# Altium schematic sheet MINIRACER-POWER.SchDoc
size A4
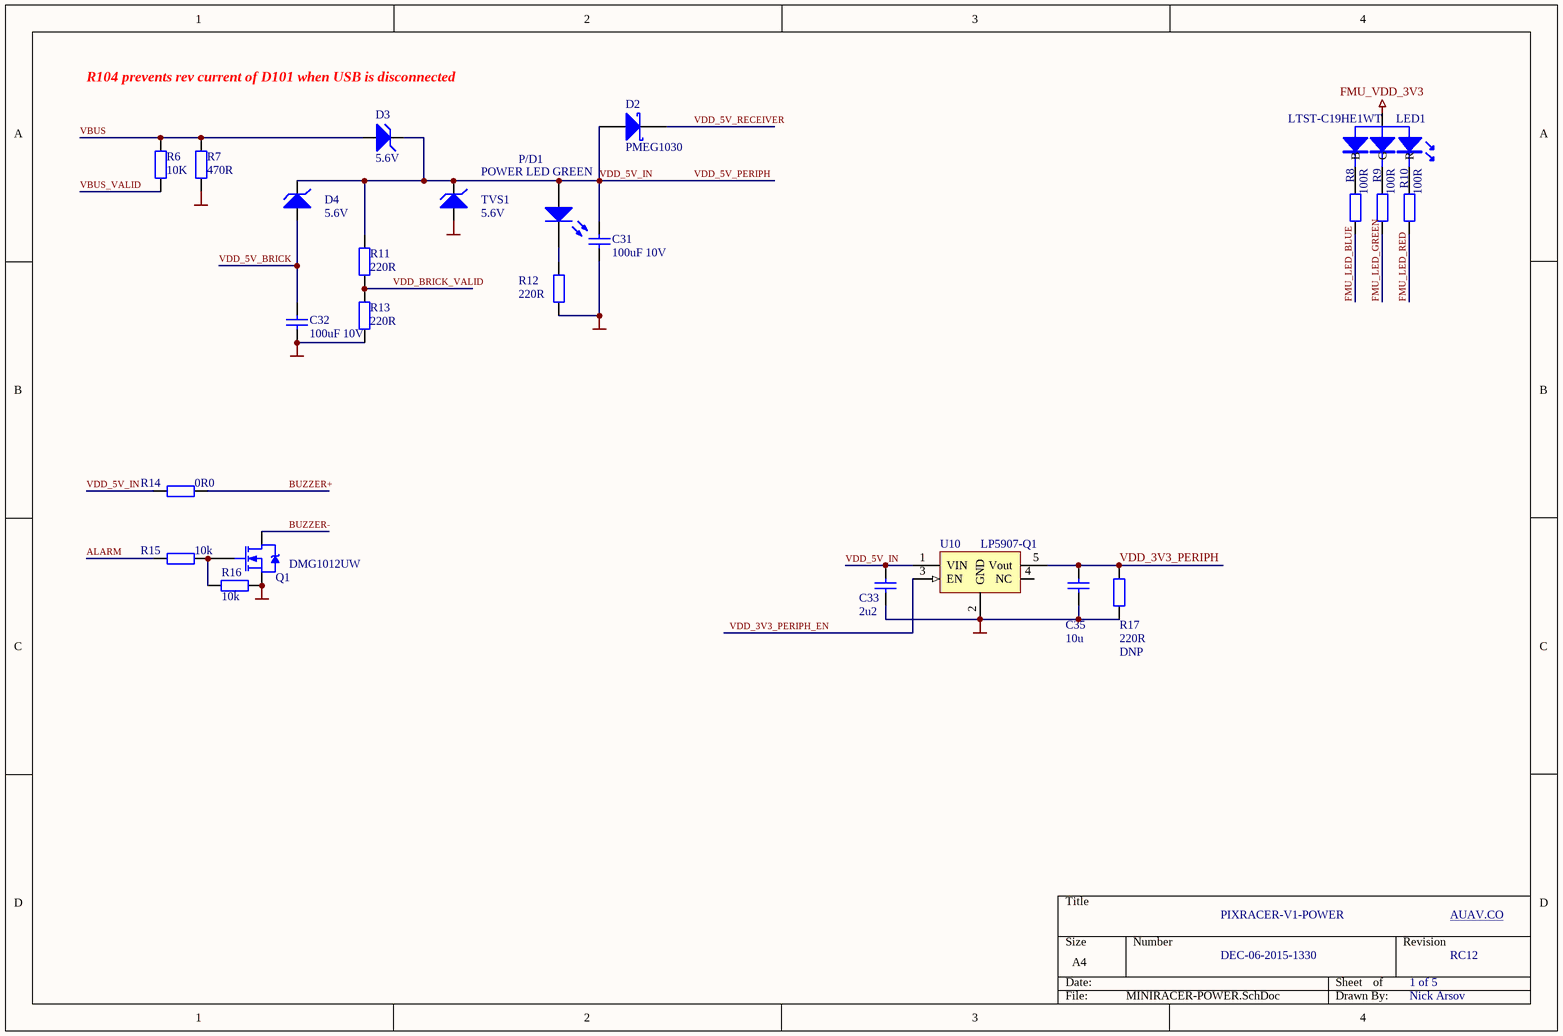
[diagram p0: MINIRACER-POWER.SchDoc]

## Parts
C31  100uF 10V  [0805A]
C32  100uF 10V  [0805A]
C33  2u2  [0603A]
C35  10u  [0603A]
D2  PMEG1030  [sod323f]
D3  5.6V  [SOD123F]
D4  5.6V  [SOD123F]
LED1  LTST-C19HE1WT  [LTST-C19HE1WT]
P/D1  POWER LED GREEN  [0603A]
Q1  DMG1012UW  [2N7002-SOT323]
R6  10K  [0603A]
R7  470R  [0603A]
R8  100R  [0402A]
R9  100R  [0402A]
R10  100R  [0402A]
R11  220R  [0603A]
R12  220R  [0603A]
R13  220R  [0603A]
R14  0R0  [0402A]
R15  10k  [0402A]
R16  10k  [0402A]
R17  220R  REM: DNP  [0402A]
TVS1  5.6V  [SOD123F]
U10  LP5907-Q1  [SOT23-5]

## Nets
FMU_VDD_3V3: LED1.4(A)
GND: C31.1 C32.1 C33.1 C35.1 Q1.2(S) R7.1 R12.1 R13.2 R16.2 R17.1 TVS1.1(A) U10.2(GND)
ALARM: R15.2
BUZZER+: R14.1
BUZZER-: Q1.1(D)
FMU_LED_BLUE: R8.1
FMU_LED_GREEN: R9.1
FMU_LED_RED: R10.1
VBUS: D3.1(A) R6.2 R7.2
VBUS_VALID: R6.1
VDD_3V3_PERIPH: C35.2 R17.2 U10.5(Vout)
VDD_3V3_PERIPH_EN: U10.3(EN)
VDD_5V_BRICK: C32.2 D4.1(A)
VDD_5V_IN: C31.2 C33.2 D2.1(A) D3.2(K) D4.2(K) P/D1.1(A) R11.1 R14.2 TVS1.2(K) U10.1(VIN)  [also labelled VDD_5V_PERIPH]
VDD_5V_RECEIVER: D2.2(K)
VDD_BRICK_VALID: R11.2 R13.1
NetLED1_1: LED1.1(R) R10.2
NetLED1_2: LED1.2(G) R9.2
NetLED1_3: LED1.3(B) R8.2
NetP/D1_2: P/D1.2(K) R12.2
NetQ1_3: Q1.3(G) R15.1 R16.1

Not connected (* = marked no-connect by the designer): U10 4(NC)

## Notes on the sheet
- R104 prevents rev current of D101 when USB is disconnected
- PIXRACER-V1-POWER
- AUAV.CO
- DEC-06-2015-1330
- 1 of 5
- RC12
- Nick Arsov

## Library data of the parts
C31-C33 C35 = Cap: Capacitor; Value: 100pF; Published: 8-Jun-2000; LatestRevisionDate: 17-Jul-2002; LatestRevisionNote: Re-released for DXP Platform.; PackageReference: RAD-0.3; Publisher: Altium Limited
  C31 C32: PackageDescription: Radial Cap, Thru-Hole; 2 Leads; 0.3 in Pin Spacing
D2 = D Schottky: Schottky Diode; Published: 8-Jun-2000; LatestRevisionDate: 17-Jul-2002; LatestRevisionNote: Re-released for DXP Platform.; PackageReference: SMB; Publisher: Altium Limited; PackageDescription: DO-214-AA/SMB; 2 C-Bend Leads; Body 5.3 x 3.6 mm, inc. leads (LxW); Code_JEDEC: DO-214-AA
D3 D4 TVS1 = D Zener: Zener Diode; Published: 8-Jun-2000; LatestRevisionDate: 17-Jul-2002; LatestRevisionNote: Re-released for DXP Platform.; PackageReference: DIODE-0.7; Publisher: Altium Limited; PackageDescription: Diode, Thru-Hole; 2 Leads; 0.7 in Pin Spacing
LED1 = RGB_LED_5MM
P/D1 = LED0: Typical INFRARED GaAs LED; Published: 8-Jun-2000; LatestRevisionDate: 08-Jul-2005; LatestRevisionNote: Mech Layer 1 removed.; PackageReference: LED-0; Publisher: Altium Limited; PackageDescription: LED; 2 Leads
Q1 = NMOS-2: N-Channel Power MOSFET; Note: Pin 2 is electrically connected to pin 4.; Published: 8-Jun-2000; LatestRevisionDate: 17-Jul-2002; LatestRevisionNote: Re-released for DXP Platform.; DatasheetDocument: PD-9.814; PackageReference: TO-220AB; Publisher: Altium Limited; Code_JEDEC: TO-220-AB; ComponentLink1Description: Manufacturer Link; ComponentLink1URL: http://www.irf.com/
R6-R17 = Res2: Resistor; Value: 1K; Published: 8-Jun-2000; LatestRevisionDate: 17-Jul-2002; LatestRevisionNote: Re-released for DXP Platform.; PackageReference: AXIAL-0.4; Publisher: Altium Limited
  R6 R7 R11-R17: PackageDescription: Axial Device, Thru-Hole; 2 Leads; 0.4 in Pin Spacing